# EasyEDA Pro project Rain_Sensor_PCB.epro

# Board PCB1
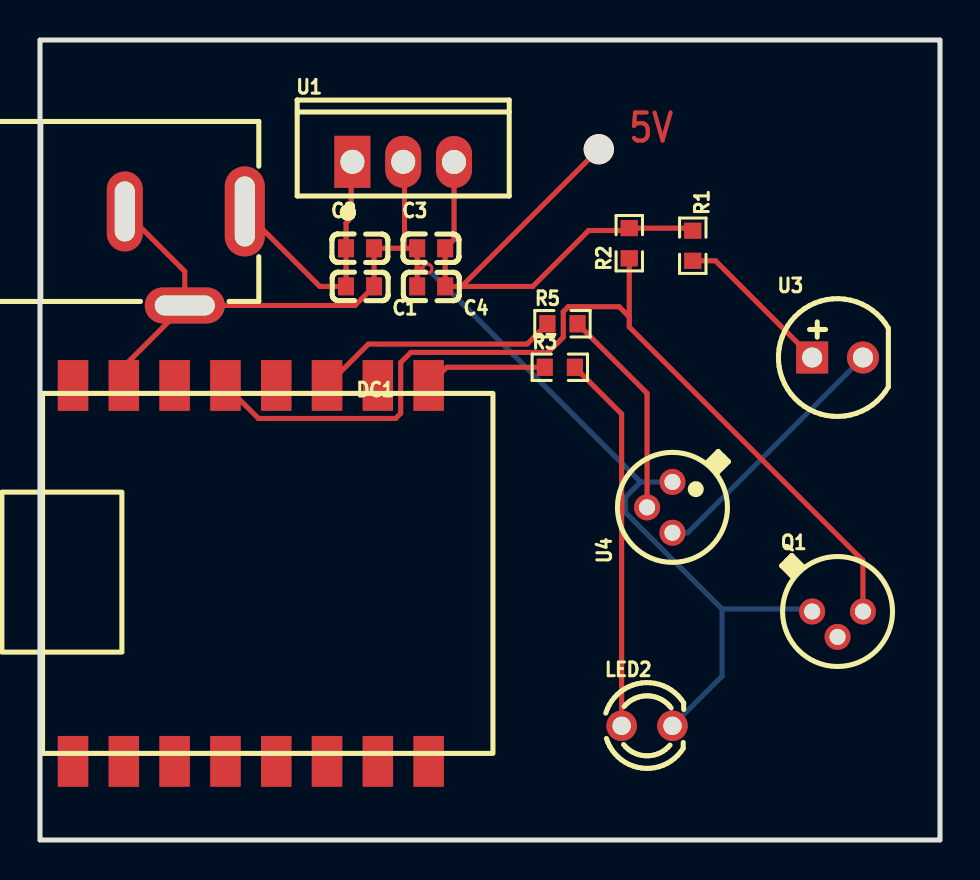
[diagram p0: board, top side]
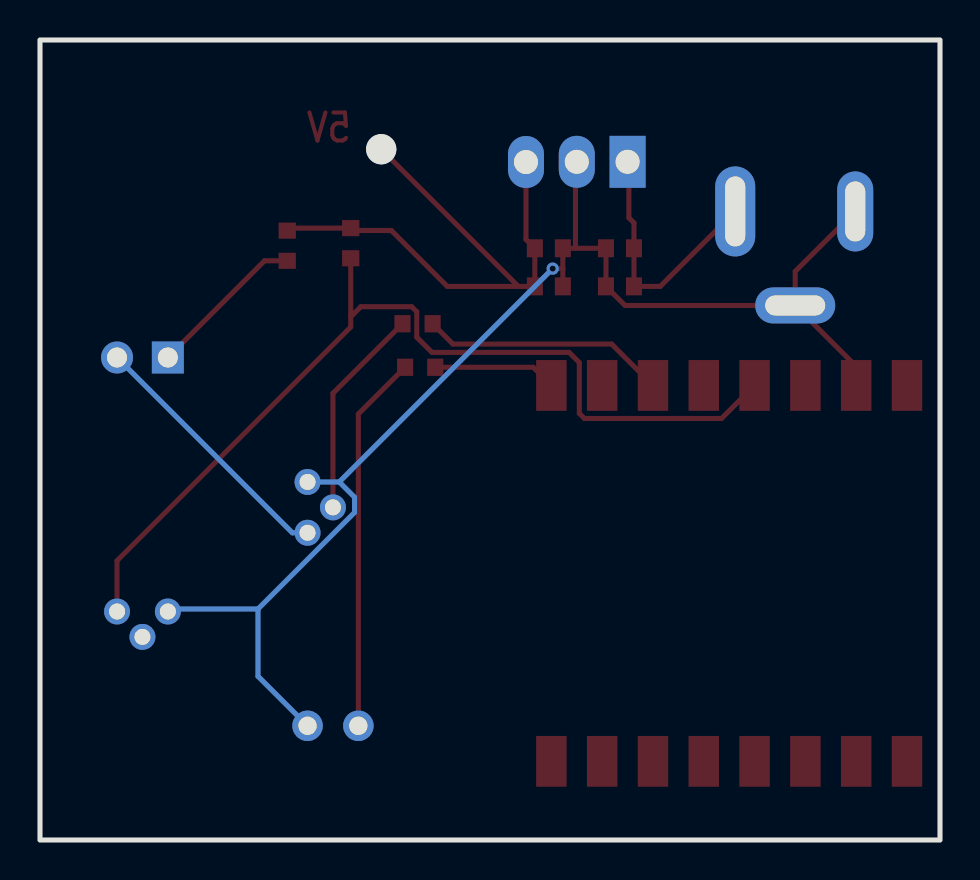
[diagram p1: board, bottom side, seen from below]

Outline 45 x 40 mm; copper layers: Top Layer, Bottom Layer. Coordinates in mm from the lower left corner of the outline.
Outline path: rectangle 0,40 45,0
Stack: Top Layer 0.035mm / Dielectric1 1.51mm FR4 er 4.5 / Bottom Layer 0.035mm

## Design rules (mm)
template: JLCPCB Capability(Two Layers Board)
spacing copperThickness1oz (default): track to track 0.102, other pairs 0.152 to 0.3
spacing copperThickness2oz: track to track 0.203, other pairs 0.152 to 0.3
track width copperThickness1oz (default): min 0.127, default 0.254, max 2.54
track width copperThickness2oz: min 0.203, default 0.254, max 2.54
differential pair differentialPair (default): width min 0.127, default 0.254, max 2.54; gap min 0.152, default 0.152
via viaSize (default): diameter min 0.5, default 0.61, max 10; hole min 0.3, default 0.305, max 6.3

## Placement (name value [footprint] x y rotation side)
C1  100uF  [C0603]  16 27.68 180 top
C2  100nF  [C0603]  16 29.59 0 top
C3  100uF  [C0603]  19.56 29.59 0 top
C4  100nF  [C0603]  19.56 27.68 180 top
DC1  PJ-002AH  [DC-IN-TH_PJ-002AH]  7.24 29.08 180 top
LED2  TJ-L3FYTXHAMCGLFLC0A-A5  [LED-TH_BD3.0-P2.54-FD]  30.35 5.71 0 top
NOREF  -  [Pad_e859]  27.94 34.54 0 top
Q1  BPW77NB  [TO-18-3]  39.88 10.79 0 top
R1  330  [R0603]  32.64 29.71 270 top
R2  10K  [R0603]  29.46 29.84 90 top
R3  220  [R0603]  25.99 23.64 0 top
R5  1K  [R0603]  26.12 25.81 0 top
U1  LM7805T  [TO-220-3_L10.0-W4.5-P2.54-L]  18.16 33.9 0 top
U2  -  [ESP32-C3-SUPER-MINI]  9.78 13.33 90 top
U3  SFH 4555-CWDW  [LED-TH_BD5.8-P2.54-RD]  39.88 24.12 0 top
U4  2N2222A  [TO-18-3_BD5.6_L14C1]  30.99 16.63 90 top

## Footprints (pads in the part's own frame, mm; a bottom-side part is the same pattern mirrored in y, then rotated)
C0603
  rect 0.8x0.9 smd: 1(-0.7,0) 2(0.7,0)
DC-IN-TH_PJ-002AH
  oval 2x4.5 hole 1x3.5: 1(-3,-2.35)
  oval 1.8x4 hole 1x3: 2(3,-2.35)
  oval 4x1.8 hole 3x1: 3(0,2.35)
ESP32-C3-SUPER-MINI
  rect 2.54x1.524 smd: 1(-9.398,8.128) 2(-9.398,5.588) 3(-9.398,3.048) 4(-9.398,0.508) 5(-9.398,-2.032) 6(-9.398,-4.572) 7(-9.398,-7.112) 8(-9.398,-9.652) 9(9.398,-9.652) 10(9.398,-7.112) 11(9.398,-4.572) 12(9.398,-2.032) 13(9.398,0.508) 14(9.398,3.048) 15(9.398,5.588) 16(9.398,8.128)
LED-TH_BD3.0-P2.54-FD
  round 1.524 hole 0.914: 1(-1.27,0) 2(1.27,0)
LED-TH_BD5.8-P2.54-RD
  round 1.6 hole 1: 1(1.27,0)
  rect 1.6x1.6 hole 1: 2(-1.27,0)
Pad_e859
  round 1.524 hole 1.5: 1(0,0)
R0603
  rect 0.806x0.864 smd: 1(-0.753,0) 2(0.753,0)
TO-18-3
  round 1.3 hole 0.8: 1(-1.27,0.635) 2(0,-0.635) 3(1.27,0.635)
TO-18-3_BD5.6_L14C1
  round 1.3 hole 0.8: 1(1.27,-0.635) 2(0,0.635) 3(-1.27,-0.635)
TO-220-3_L10.0-W4.5-P2.54-L
  rect 1.8x2.6 hole 1.2: 1(-2.54,0.005)
  oval 1.8x2.6 hole 1.2: 2(0,0.005) 3(2.54,-0.005)

## Nets
GND: C1.1 C2.2 C3.1 C4.2 DC1.2 DC1.3 LED2.2 Q1.1 U1.2 U2.15 U4.1
10-30V: C1.2 C2.1 DC1.1 U1.1
$1N363: C3.2 C4.1 NOREF.1 R1.1 R2.2 U1.3
$1N686: R1.2 U3.2
$1N777: U3.1 U4.3
$1N1009: Q1.3 R2.1 U2.13
$1N1658: R3.1 U2.9
$1N1667: LED2.1 R3.2
$1N2292: R5.2 U4.2
$1N2295: R5.1 U2.11

Pads without a net: Q1 2; U2 1 2 3 4 5 6 7 8 10 12 14 16

## Via types
v1: diameter 0.61, hole 0.305, Top Layer to Bottom Layer, 1 via

## Routing (per net, layer and track width the routed paths; a pad name or vN(x,y) marks a point on that pad's centre or on a via; arc(x,y) is an arc through that point)
GND: length 68.7
  Top Layer w0.254: DC1.3 7.24,28.43 DC1.2 ; DC1.3 4.19,23.68 U2.15 ; DC1.3 15.75,26.73 C1.1 C2.2 18.23,29.59 ; 18.23,29.59 C3.1 18.86,28.57 ; 18.23,29.59 18.23,33.84 U1.2 ; 18.86,28.57 v1(19.37,28.57) ; 18.86,28.57 C4.2
  Bottom Layer w0.254: 34.1,11.55 29.27,16.38 29.27,17.14 30.03,17.9 ; 34.1,11.55 38.48,11.55 38.61,11.42 ; 34.1,11.55 34.1,8.19 LED2.2 ; v1(19.37,28.57) 30.03,17.9 ; 30.03,17.9 U4.1
10-30V: length 13
  Top Layer w0.254: U1.1 15.56,33.84 15.56,31.11 15.3,30.86 C2.1 C1.2 13.99,27.68 DC1.1
$1N363: length 29.7
  Top Layer w0.254: U1.3 20.7,30.03 C3.2 C4.1 21.08,27.68 ; NOREF.1 21.08,27.68 ; 21.08,27.68 24.64,27.68 27.43,30.47 29.35,30.47 R2.2 32.51,30.59 R1.1
$1N686: length 8
  Top Layer w0.254: U3.2 33.77,28.96 R1.2
$1N777: length 13.2
  Bottom Layer w0.254: U4.3 32.38,15.36 U3.1
$1N1009: length 48.1
  Top Layer w0.254: 29.46,26.16 R2.1 ; 29.46,26.16 28.96,26.67 26.42,26.67 26.16,26.41 26.16,25.14 25.4,24.38 18.54,24.38 18.03,23.87 18.03,21.33 17.78,21.08 10.92,21.08 U2.13 ; 29.46,26.16 29.46,25.65 41.15,13.97 41.15,11.42
$1N1658: length 6.2
  Top Layer w0.254: R3.1 20.34,23.64 19.43,22.73
$1N1667: length 18.9
  Top Layer w0.254: R3.2 29.08,21.3 LED2.1
$1N2292: length 10.6
  Top Layer w0.254: R5.2 30.35,22.34 U4.2
$1N2295: length 12.3
  Top Layer w0.254: 25.37,25.81 24.35,24.8 16.42,24.8 U2.11

## Text on the board
Top Layer: 5V
